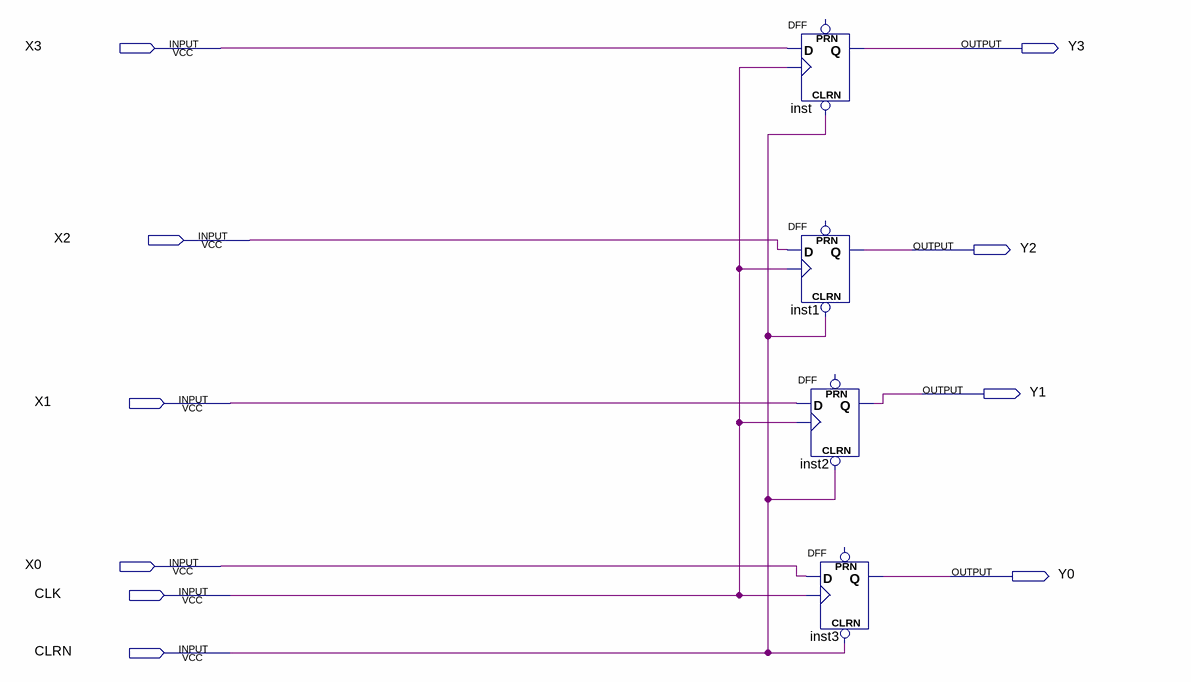
[diagram p0: schematic sheet]
// Quartus schematic register4bit.bdf as structural Verilog: 4 symbols, 10 pins
module register4bit (
  input  X3,
  input  X2,
  input  X1,
  input  X0,
  input  CLK,
  input  CLRN,
  output Y3,
  output Y2,
  output Y1,
  output Y0
);

  DFF inst (.CLRN(CLRN), .CLK(CLK), .D(X3), .Q(Y3));  // open: PRN
  DFF inst1 (.CLRN(CLRN), .CLK(CLK), .D(X2), .Q(Y2));  // open: PRN
  DFF inst2 (.CLRN(CLRN), .CLK(CLK), .D(X1), .Q(Y1));  // open: PRN
  DFF inst3 (.CLRN(CLRN), .CLK(CLK), .D(X0), .Q(Y0));  // open: PRN
endmodule
